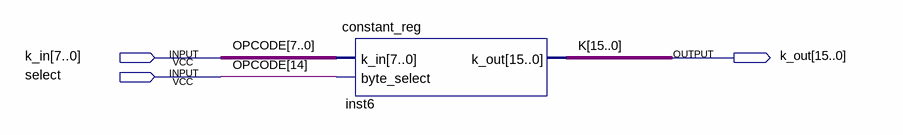
[diagram p0: schematic sheet]
// Quartus schematic testbench.bdf as structural Verilog: 1 symbols, 3 pins
module testbench (
  input  [7:0] k_in,
  input  select,
  output [15:0] k_out
);

  constant_reg inst6 (.k_in(k_in), .byte_select(select), .k_out(k_out));

  // Other names for the same wires on the sheet: K[15:0] = k_out; OPCODE (some bits) = {select, k_in}
endmodule
